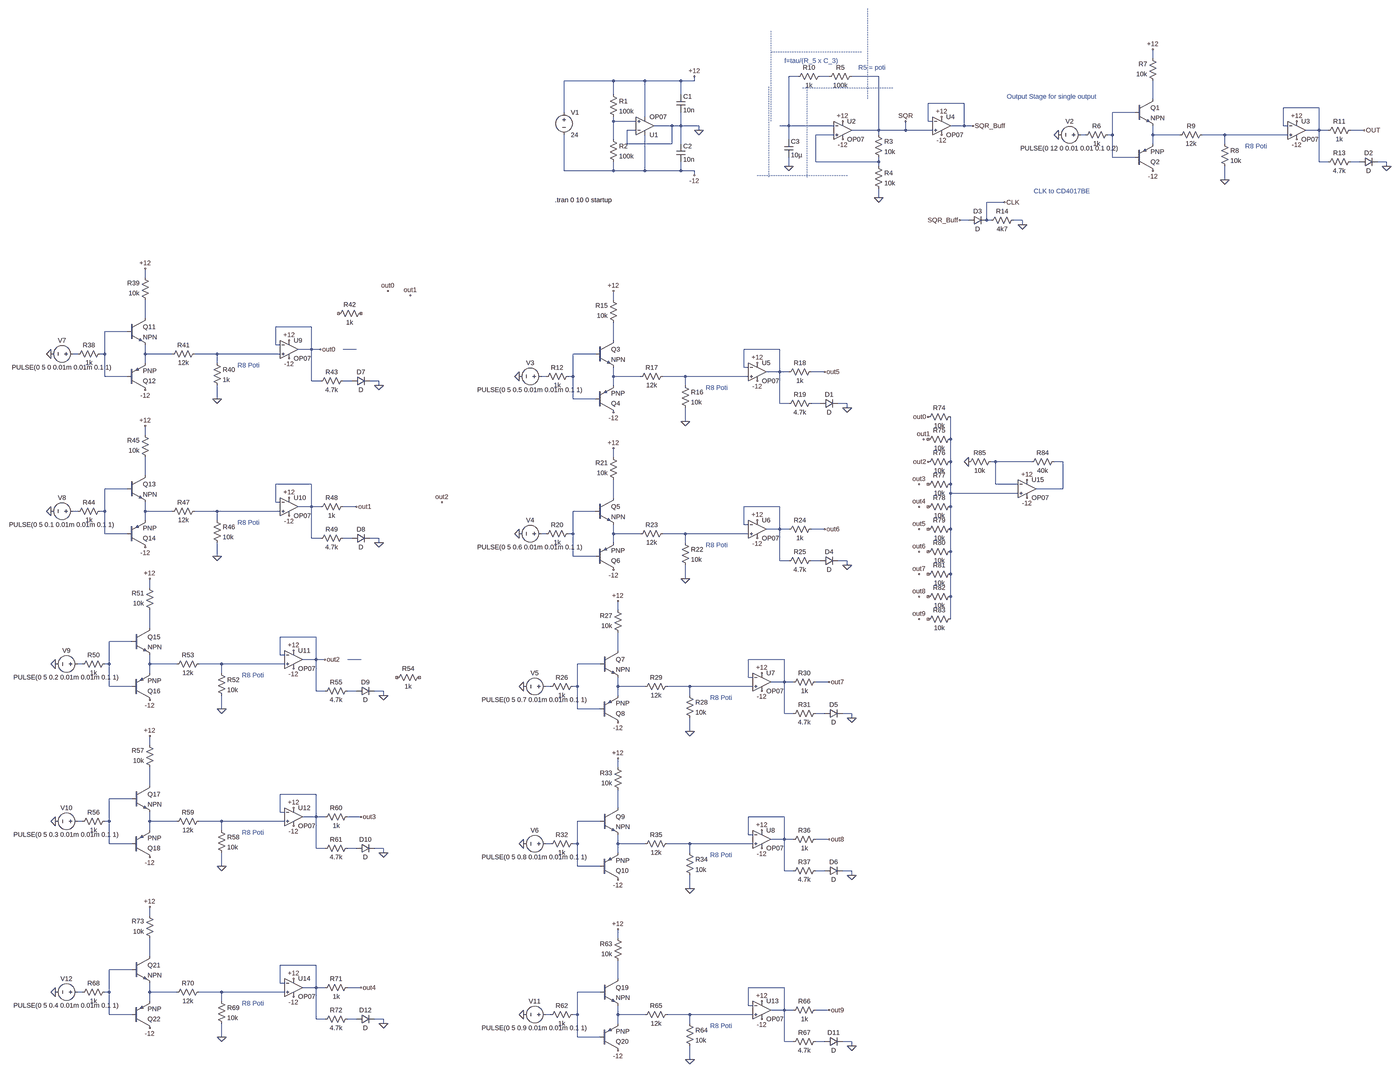
[diagram p0: schematic Draft1.asc, whole sheet]
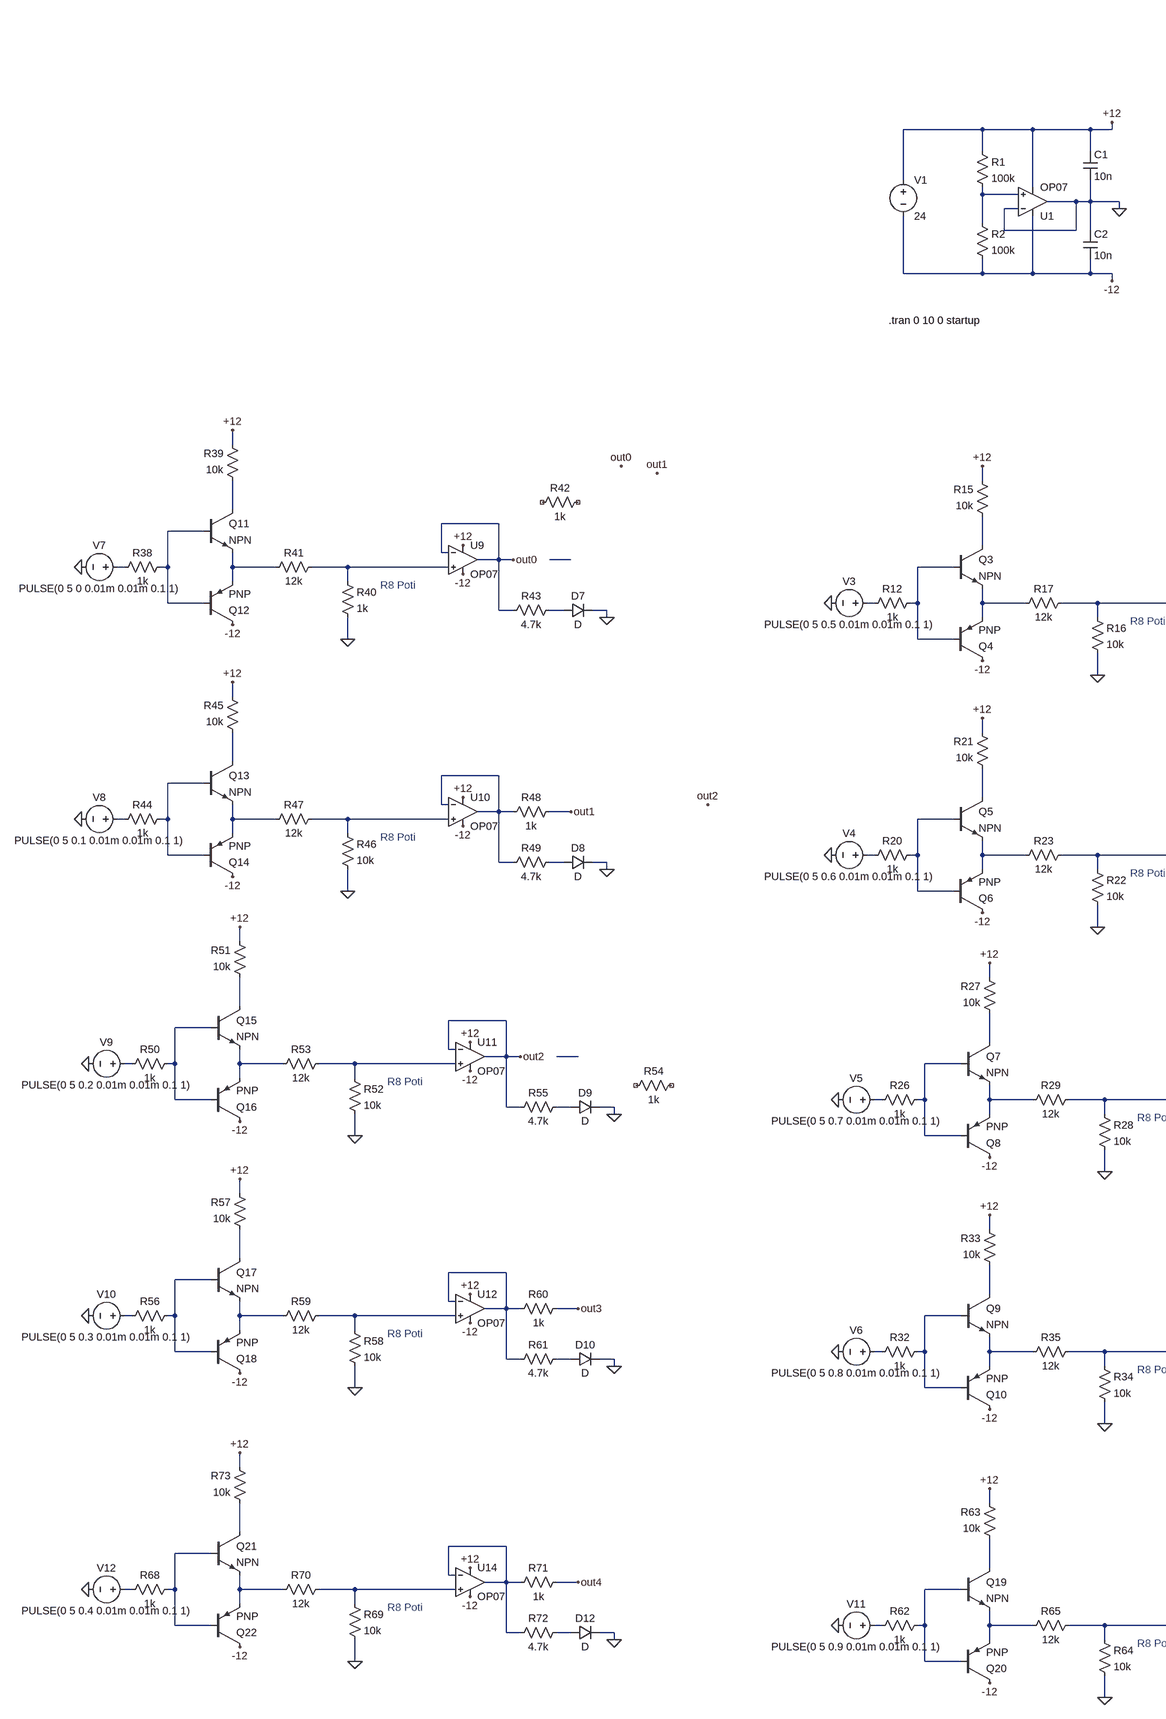
[diagram p1: schematic Draft1.asc, part, row 1 of 1, column 1 of 2]
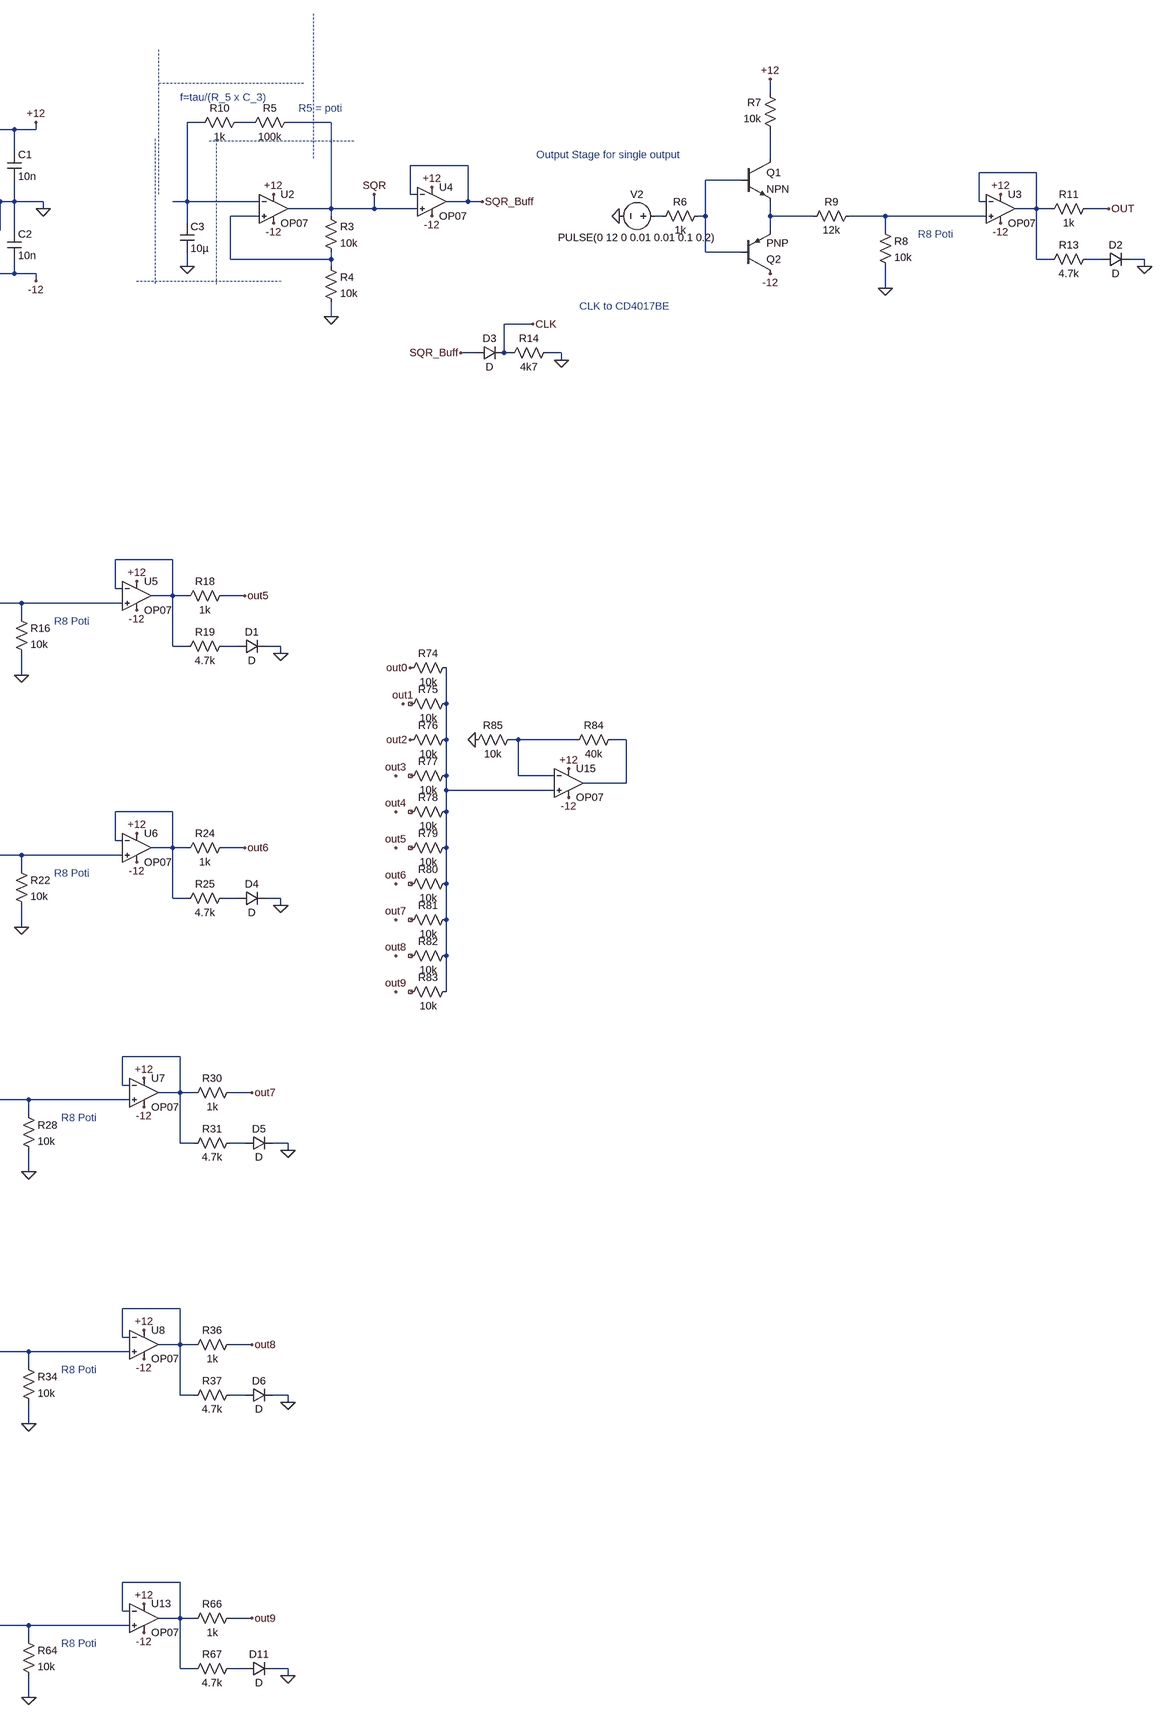
[diagram p2: schematic Draft1.asc, part, row 1 of 1, column 2 of 2]
Draft1.asc, the LTspice schematic file:
Version 4.1
SHEET 1 2912 3476
WIRE 1936 -240 1936 -272
WIRE 672 -176 640 -176
WIRE 784 -176 752 -176
WIRE 960 -176 864 -176
WIRE 16 -160 -160 -160
WIRE 128 -160 16 -160
WIRE 256 -160 128 -160
WIRE 304 -160 304 -176
WIRE 304 -160 256 -160
WIRE 16 -112 16 -160
WIRE 256 -112 256 -160
WIRE 1936 -96 1936 -160
WIRE 1264 -80 1136 -80
WIRE 2528 -64 2400 -64
WIRE -160 -48 -160 -160
WIRE 1872 -48 1792 -48
WIRE 128 -32 128 -160
WIRE 16 -16 16 -32
WIRE 96 -16 16 -16
WIRE 1136 -16 1136 -80
WIRE 1152 -16 1136 -16
WIRE 224 0 160 0
WIRE 256 0 256 -48
WIRE 256 0 224 0
WIRE 320 0 256 0
WIRE 640 0 640 -176
WIRE 640 0 608 0
WIRE 800 0 640 0
WIRE 1264 0 1264 -80
WIRE 1264 0 1216 0
WIRE 1296 0 1264 0
WIRE 2400 0 2400 -64
WIRE 2416 0 2400 0
WIRE 96 16 64 16
WIRE 320 16 320 0
WIRE 960 16 960 -176
WIRE 960 16 864 16
WIRE 1056 16 1056 -16
WIRE 1056 16 960 16
WIRE 1152 16 1056 16
WIRE 2528 16 2528 -64
WIRE 2528 16 2480 16
WIRE 2560 16 2528 16
WIRE 2688 16 2640 16
WIRE 800 32 736 32
WIRE 960 32 960 16
WIRE 1696 32 1680 32
WIRE 1792 32 1792 -48
WIRE 1792 32 1776 32
WIRE 1936 32 1936 0
WIRE 2032 32 1936 32
WIRE 2192 32 2112 32
WIRE 2416 32 2192 32
WIRE 16 48 16 -16
WIRE 640 48 640 0
WIRE 64 64 64 16
WIRE 224 64 224 0
WIRE 224 64 64 64
WIRE 256 64 256 0
WIRE 1936 64 1936 32
WIRE 2192 64 2192 32
WIRE 1792 112 1792 32
WIRE 1872 112 1792 112
WIRE 736 128 736 32
WIRE 960 128 960 112
WIRE 960 128 736 128
WIRE 2528 128 2528 16
WIRE 2560 128 2528 128
WIRE 2672 128 2640 128
WIRE 2768 128 2736 128
WIRE 640 144 640 112
WIRE 960 144 960 128
WIRE 2768 144 2768 128
WIRE -160 160 -160 32
WIRE 16 160 16 128
WIRE 16 160 -160 160
WIRE 128 160 128 32
WIRE 128 160 16 160
WIRE 256 160 256 128
WIRE 256 160 128 160
WIRE 304 160 256 160
WIRE 304 176 304 160
WIRE 2192 192 2192 144
WIRE 960 256 960 224
WIRE 1408 272 1344 272
WIRE 1280 336 1248 336
WIRE 1344 336 1344 272
WIRE 1360 336 1344 336
WIRE 1472 336 1440 336
WIRE 1472 352 1472 336
WIRE -1664 640 -1664 608
WIRE 16 720 16 688
WIRE -1664 784 -1664 720
WIRE -1072 816 -1200 816
WIRE -1728 832 -1808 832
WIRE 16 864 16 800
WIRE -1200 880 -1200 816
WIRE -1184 880 -1200 880
WIRE -1072 896 -1072 816
WIRE -1072 896 -1120 896
WIRE -1040 896 -1072 896
WIRE -912 896 -960 896
WIRE 608 896 480 896
WIRE -1904 912 -1920 912
WIRE -1808 912 -1808 832
WIRE -1808 912 -1824 912
WIRE -1664 912 -1664 880
WIRE -1568 912 -1664 912
WIRE -1408 912 -1488 912
WIRE -1184 912 -1408 912
WIRE -48 912 -128 912
WIRE -1664 944 -1664 912
WIRE -1408 944 -1408 912
WIRE 480 960 480 896
WIRE 496 960 480 960
WIRE 608 976 608 896
WIRE 608 976 560 976
WIRE 640 976 608 976
WIRE 768 976 720 976
WIRE -1808 992 -1808 912
WIRE -1728 992 -1808 992
WIRE -224 992 -240 992
WIRE -128 992 -128 912
WIRE -128 992 -144 992
WIRE 16 992 16 960
WIRE 112 992 16 992
WIRE 272 992 192 992
WIRE 496 992 272 992
WIRE -1072 1008 -1072 896
WIRE -1040 1008 -1072 1008
WIRE -928 1008 -960 1008
WIRE -832 1008 -864 1008
WIRE -832 1024 -832 1008
WIRE 16 1024 16 992
WIRE 272 1024 272 992
WIRE -1408 1072 -1408 1024
WIRE -128 1072 -128 992
WIRE -48 1072 -128 1072
WIRE 608 1088 608 976
WIRE 640 1088 608 1088
WIRE 752 1088 720 1088
WIRE 848 1088 816 1088
WIRE 848 1104 848 1088
WIRE 272 1152 272 1104
WIRE -1664 1200 -1664 1168
WIRE 1216 1216 1216 1136
WIRE 16 1280 16 1248
WIRE 1216 1296 1216 1216
WIRE 1376 1296 1360 1296
WIRE 1504 1296 1376 1296
WIRE 1616 1296 1584 1296
WIRE -1664 1344 -1664 1280
WIRE -1072 1376 -1200 1376
WIRE 1216 1376 1216 1296
WIRE 1376 1376 1376 1296
WIRE 1456 1376 1376 1376
WIRE -1728 1392 -1808 1392
WIRE 1616 1392 1616 1296
WIRE 1616 1392 1520 1392
WIRE 1216 1408 1216 1376
WIRE 1456 1408 1216 1408
WIRE 16 1424 16 1360
WIRE -1200 1440 -1200 1376
WIRE -1184 1440 -1200 1440
WIRE -1072 1456 -1072 1376
WIRE -1072 1456 -1120 1456
WIRE -1040 1456 -1072 1456
WIRE -912 1456 -960 1456
WIRE 608 1456 480 1456
WIRE 1216 1456 1216 1408
WIRE -1904 1472 -1920 1472
WIRE -1808 1472 -1808 1392
WIRE -1808 1472 -1824 1472
WIRE -1664 1472 -1664 1440
WIRE -1568 1472 -1664 1472
WIRE -1408 1472 -1488 1472
WIRE -1184 1472 -1408 1472
WIRE -48 1472 -128 1472
WIRE -1664 1504 -1664 1472
WIRE -1408 1504 -1408 1472
WIRE 480 1520 480 1456
WIRE 496 1520 480 1520
WIRE 608 1536 608 1456
WIRE 608 1536 560 1536
WIRE 640 1536 608 1536
WIRE 768 1536 720 1536
WIRE 1216 1536 1216 1456
WIRE -1808 1552 -1808 1472
WIRE -1728 1552 -1808 1552
WIRE -224 1552 -240 1552
WIRE -128 1552 -128 1472
WIRE -128 1552 -144 1552
WIRE 16 1552 16 1520
WIRE 112 1552 16 1552
WIRE 272 1552 192 1552
WIRE 496 1552 272 1552
WIRE -1072 1568 -1072 1456
WIRE -1040 1568 -1072 1568
WIRE -928 1568 -960 1568
WIRE -832 1568 -864 1568
WIRE -832 1584 -832 1568
WIRE 16 1584 16 1552
WIRE 272 1584 272 1552
WIRE 1216 1616 1216 1536
WIRE -1408 1632 -1408 1584
WIRE -128 1632 -128 1552
WIRE -48 1632 -128 1632
WIRE 608 1648 608 1536
WIRE 640 1648 608 1648
WIRE 752 1648 720 1648
WIRE 848 1648 816 1648
WIRE 848 1664 848 1648
WIRE 1216 1696 1216 1616
WIRE 272 1712 272 1664
WIRE -1648 1744 -1648 1712
WIRE 1216 1776 1216 1696
WIRE 32 1824 32 1792
WIRE 1216 1856 1216 1776
WIRE -1648 1888 -1648 1824
WIRE -1056 1920 -1184 1920
WIRE -1712 1936 -1792 1936
WIRE 32 1968 32 1904
WIRE -1184 1984 -1184 1920
WIRE -1168 1984 -1184 1984
WIRE -1056 2000 -1056 1920
WIRE -1056 2000 -1104 2000
WIRE -1024 2000 -1056 2000
WIRE -896 2000 -944 2000
WIRE 624 2000 496 2000
WIRE -1888 2016 -1904 2016
WIRE -1792 2016 -1792 1936
WIRE -1792 2016 -1808 2016
WIRE -1648 2016 -1648 1984
WIRE -1552 2016 -1648 2016
WIRE -1392 2016 -1472 2016
WIRE -1168 2016 -1392 2016
WIRE -32 2016 -112 2016
WIRE -1648 2048 -1648 2016
WIRE -1392 2048 -1392 2016
WIRE 496 2064 496 2000
WIRE 512 2064 496 2064
WIRE 624 2080 624 2000
WIRE 624 2080 576 2080
WIRE 656 2080 624 2080
WIRE 784 2080 736 2080
WIRE -1792 2096 -1792 2016
WIRE -1712 2096 -1792 2096
WIRE -208 2096 -224 2096
WIRE -112 2096 -112 2016
WIRE -112 2096 -128 2096
WIRE 32 2096 32 2064
WIRE 128 2096 32 2096
WIRE 288 2096 208 2096
WIRE 512 2096 288 2096
WIRE -1056 2112 -1056 2000
WIRE -1024 2112 -1056 2112
WIRE -912 2112 -944 2112
WIRE -816 2112 -848 2112
WIRE -816 2128 -816 2112
WIRE 32 2128 32 2096
WIRE 288 2128 288 2096
WIRE -1392 2176 -1392 2128
WIRE -112 2176 -112 2096
WIRE -32 2176 -112 2176
WIRE 624 2192 624 2080
WIRE 656 2192 624 2192
WIRE 768 2192 736 2192
WIRE 864 2192 832 2192
WIRE 864 2208 864 2192
WIRE 288 2256 288 2208
WIRE -1648 2304 -1648 2272
WIRE 32 2384 32 2352
WIRE -1648 2448 -1648 2384
WIRE -1056 2480 -1184 2480
WIRE -1712 2496 -1792 2496
WIRE 32 2528 32 2464
WIRE -1184 2544 -1184 2480
WIRE -1168 2544 -1184 2544
WIRE -1056 2560 -1056 2480
WIRE -1056 2560 -1104 2560
WIRE -1024 2560 -1056 2560
WIRE -896 2560 -944 2560
WIRE 624 2560 496 2560
WIRE -1888 2576 -1904 2576
WIRE -1792 2576 -1792 2496
WIRE -1792 2576 -1808 2576
WIRE -1648 2576 -1648 2544
WIRE -1552 2576 -1648 2576
WIRE -1392 2576 -1472 2576
WIRE -1168 2576 -1392 2576
WIRE -32 2576 -112 2576
WIRE -1648 2608 -1648 2576
WIRE -1392 2608 -1392 2576
WIRE 496 2624 496 2560
WIRE 512 2624 496 2624
WIRE 624 2640 624 2560
WIRE 624 2640 576 2640
WIRE 656 2640 624 2640
WIRE 784 2640 736 2640
WIRE -1792 2656 -1792 2576
WIRE -1712 2656 -1792 2656
WIRE -208 2656 -224 2656
WIRE -112 2656 -112 2576
WIRE -112 2656 -128 2656
WIRE 32 2656 32 2624
WIRE 128 2656 32 2656
WIRE 288 2656 208 2656
WIRE 512 2656 288 2656
WIRE -1056 2672 -1056 2560
WIRE -1024 2672 -1056 2672
WIRE -912 2672 -944 2672
WIRE -816 2672 -848 2672
WIRE -816 2688 -816 2672
WIRE 32 2688 32 2656
WIRE 288 2688 288 2656
WIRE -1392 2736 -1392 2688
WIRE -112 2736 -112 2656
WIRE -32 2736 -112 2736
WIRE 624 2752 624 2640
WIRE 656 2752 624 2752
WIRE 768 2752 736 2752
WIRE 864 2752 832 2752
WIRE 864 2768 864 2752
WIRE 288 2816 288 2768
WIRE -1648 2912 -1648 2880
WIRE 32 2992 32 2960
WIRE -1648 3056 -1648 2992
WIRE -1056 3088 -1184 3088
WIRE -1712 3104 -1792 3104
WIRE 32 3136 32 3072
WIRE -1184 3152 -1184 3088
WIRE -1168 3152 -1184 3152
WIRE -1056 3168 -1056 3088
WIRE -1056 3168 -1104 3168
WIRE -1024 3168 -1056 3168
WIRE -896 3168 -944 3168
WIRE 624 3168 496 3168
WIRE -1888 3184 -1904 3184
WIRE -1792 3184 -1792 3104
WIRE -1792 3184 -1808 3184
WIRE -1648 3184 -1648 3152
WIRE -1552 3184 -1648 3184
WIRE -1392 3184 -1472 3184
WIRE -1168 3184 -1392 3184
WIRE -32 3184 -112 3184
WIRE -1648 3216 -1648 3184
WIRE -1392 3216 -1392 3184
WIRE 496 3232 496 3168
WIRE 512 3232 496 3232
WIRE 624 3248 624 3168
WIRE 624 3248 576 3248
WIRE 656 3248 624 3248
WIRE 784 3248 736 3248
WIRE -1792 3264 -1792 3184
WIRE -1712 3264 -1792 3264
WIRE -208 3264 -224 3264
WIRE -112 3264 -112 3184
WIRE -112 3264 -128 3264
WIRE 32 3264 32 3232
WIRE 128 3264 32 3264
WIRE 288 3264 208 3264
WIRE 512 3264 288 3264
WIRE -1056 3280 -1056 3168
WIRE -1024 3280 -1056 3280
WIRE -912 3280 -944 3280
WIRE -816 3280 -848 3280
WIRE -816 3296 -816 3280
WIRE 32 3296 32 3264
WIRE 288 3296 288 3264
WIRE -1392 3344 -1392 3296
WIRE -112 3344 -112 3264
WIRE -32 3344 -112 3344
WIRE 624 3360 624 3248
WIRE 656 3360 624 3360
WIRE 768 3360 736 3360
WIRE 864 3360 832 3360
WIRE 864 3376 864 3360
WIRE 288 3424 288 3376
FLAG 304 -176 +12
FLAG 304 176 -12
FLAG 320 16 0
FLAG 960 256 0
FLAG 832 48 -12
FLAG 832 -16 +12
FLAG 640 144 0
FLAG 1184 -32 +12
FLAG 1184 32 -12
FLAG 1056 -16 SQR
FLAG 1296 0 SQR_Buff
FLAG 1936 -272 +12
FLAG 2192 192 0
FLAG 1936 160 -12
FLAG 2448 -16 +12
FLAG 2448 48 -12
FLAG 2768 144 0
FLAG 2688 16 OUT
FLAG 1600 32 0
FLAG 1472 352 0
FLAG 1248 336 SQR_Buff
FLAG 1408 272 CLK
FLAG 16 688 +12
FLAG 272 1152 0
FLAG 16 1120 -12
FLAG 528 944 +12
FLAG 528 1008 -12
FLAG 848 1104 0
FLAG -320 992 0
FLAG 16 1248 +12
FLAG 272 1712 0
FLAG 16 1680 -12
FLAG 528 1504 +12
FLAG 528 1568 -12
FLAG 848 1664 0
FLAG -320 1552 0
FLAG 32 1792 +12
FLAG 288 2256 0
FLAG 32 2224 -12
FLAG 544 2048 +12
FLAG 544 2112 -12
FLAG 864 2208 0
FLAG -304 2096 0
FLAG 32 2352 +12
FLAG 288 2816 0
FLAG 32 2784 -12
FLAG 544 2608 +12
FLAG 544 2672 -12
FLAG 864 2768 0
FLAG -304 2656 0
FLAG -1664 608 +12
FLAG -1408 1072 0
FLAG -1664 1040 -12
FLAG -1152 864 +12
FLAG -1152 928 -12
FLAG -832 1024 0
FLAG -2000 912 0
FLAG -1664 1168 +12
FLAG -1408 1632 0
FLAG -1664 1600 -12
FLAG -1152 1424 +12
FLAG -1152 1488 -12
FLAG -832 1584 0
FLAG -2000 1472 0
FLAG -1648 1712 +12
FLAG -1392 2176 0
FLAG -1648 2144 -12
FLAG -1136 1968 +12
FLAG -1136 2032 -12
FLAG -816 2128 0
FLAG -1984 2016 0
FLAG -1648 2272 +12
FLAG -1392 2736 0
FLAG -1648 2704 -12
FLAG -1136 2528 +12
FLAG -1136 2592 -12
FLAG -816 2688 0
FLAG -1984 2576 0
FLAG 32 2960 +12
FLAG 288 3424 0
FLAG 32 3392 -12
FLAG 544 3216 +12
FLAG 544 3280 -12
FLAG 864 3376 0
FLAG -304 3264 0
FLAG -1392 3344 0
FLAG -1648 3312 -12
FLAG -1136 3136 +12
FLAG -1136 3200 -12
FLAG -816 3296 0
FLAG -1984 3184 0
FLAG -1040 896 out0
FLAG -800 688 out0
FLAG -912 1456 out1
FLAG -720 704 out1
FLAG -1648 2880 +12
FLAG -1024 2000 out2
FLAG -608 1440 out2
FLAG -896 2560 out3
FLAG -896 3168 out4
FLAG 768 976 out5
FLAG 768 1536 out6
FLAG 784 2080 out7
FLAG 784 2640 out8
FLAG 784 3248 out9
FLAG 1488 1360 +12
FLAG 1488 1424 -12
FLAG 1136 1136 out0
FLAG 1120 1216 out1
FLAG 1136 1296 out2
FLAG 1104 1376 out3
FLAG 1104 1456 out4
FLAG 1104 1536 out5
FLAG 1104 1616 out6
FLAG 1104 1696 out7
FLAG 1104 1776 out8
FLAG 1104 1856 out9
FLAG 1280 1296 0
SYMBOL OpAmps\\OP07 128 64 M180
SYMATTR InstName U1
SYMBOL res 0 -128 R0
SYMATTR InstName R1
SYMATTR Value 100k
SYMBOL res 0 32 R0
SYMATTR InstName R2
SYMATTR Value 100k
SYMBOL cap 240 -112 R0
SYMATTR InstName C1
SYMATTR Value 10n
SYMBOL cap 240 64 R0
SYMATTR InstName C2
SYMATTR Value 10n
SYMBOL voltage -160 -64 R0
WINDOW 123 0 0 Left 0
WINDOW 39 0 0 Left 0
SYMATTR InstName V1
SYMATTR Value 24
SYMBOL OpAmps\\OP07 832 -48 R0
SYMATTR InstName U2
SYMBOL res 944 16 R0
SYMATTR InstName R3
SYMATTR Value 10k
SYMBOL res 944 128 R0
SYMATTR InstName R4
SYMATTR Value 10k
SYMBOL res 880 -192 R90
WINDOW 0 0 56 VBottom 2
WINDOW 3 32 56 VTop 2
SYMATTR InstName R5
SYMATTR Value 100k
SYMBOL cap 624 48 R0
SYMATTR InstName C3
SYMATTR Value 10µ
SYMBOL OpAmps\\OP07 1184 -64 R0
SYMATTR InstName U4
SYMBOL res 768 -192 R90
WINDOW 0 0 56 VBottom 2
WINDOW 3 32 56 VTop 2
SYMATTR InstName R10
SYMATTR Value 1k
SYMBOL npn 1872 -96 R0
SYMATTR InstName Q1
SYMBOL res 1792 16 R90
WINDOW 0 0 56 VBottom 2
WINDOW 3 32 56 VTop 2
SYMATTR InstName R6
SYMATTR Value 1k
SYMBOL res 1952 -144 R180
WINDOW 0 36 76 Left 2
WINDOW 3 36 40 Left 2
SYMATTR InstName R7
SYMATTR Value 10k
SYMBOL res 2176 48 R0
SYMATTR InstName R8
SYMATTR Value 10k
SYMBOL pnp 1872 160 M180
SYMATTR InstName Q2
SYMBOL res 2128 16 R90
WINDOW 0 0 56 VBottom 2
WINDOW 3 32 56 VTop 2
SYMATTR InstName R9
SYMATTR Value 12k
SYMBOL OpAmps\\OP07 2448 -48 R0
SYMATTR InstName U3
SYMBOL res 2656 0 R90
WINDOW 0 0 56 VBottom 2
WINDOW 3 32 56 VTop 2
SYMATTR InstName R11
SYMATTR Value 1k
SYMBOL diode 2672 144 R270
WINDOW 0 32 32 VTop 2
WINDOW 3 0 32 VBottom 2
SYMATTR InstName D2
SYMBOL res 2656 112 R90
WINDOW 0 0 56 VBottom 2
WINDOW 3 32 56 VTop 2
SYMATTR InstName R13
SYMATTR Value 4.7k
SYMBOL voltage 1696 32 R90
WINDOW 0 -32 56 VBottom 2
WINDOW 3 32 56 VTop 2
WINDOW 123 0 0 Left 0
WINDOW 39 0 0 Left 0
SYMATTR InstName V2
SYMATTR Value PULSE(0 12 0 0.01 0.01 0.1 0.2)
SYMBOL diode 1280 352 R270
WINDOW 0 32 32 VTop 2
WINDOW 3 0 32 VBottom 2
SYMATTR InstName D3
SYMBOL res 1456 320 R90
WINDOW 0 0 56 VBottom 2
WINDOW 3 32 56 VTop 2
SYMATTR InstName R14
SYMATTR Value 4k7
SYMBOL npn -48 864 R0
SYMATTR InstName Q3
SYMBOL res -128 976 R90
WINDOW 0 0 56 VBottom 2
WINDOW 3 32 56 VTop 2
SYMATTR InstName R12
SYMATTR Value 1k
SYMBOL res 32 816 R180
WINDOW 0 36 76 Left 2
WINDOW 3 36 40 Left 2
SYMATTR InstName R15
SYMATTR Value 10k
SYMBOL res 256 1008 R0
SYMATTR InstName R16
SYMATTR Value 10k
SYMBOL pnp -48 1120 M180
SYMATTR InstName Q4
SYMBOL res 208 976 R90
WINDOW 0 0 56 VBottom 2
WINDOW 3 32 56 VTop 2
SYMATTR InstName R17
SYMATTR Value 12k
SYMBOL OpAmps\\OP07 528 912 R0
SYMATTR InstName U5
SYMBOL res 736 960 R90
WINDOW 0 0 56 VBottom 2
WINDOW 3 32 56 VTop 2
SYMATTR InstName R18
SYMATTR Value 1k
SYMBOL diode 752 1104 R270
WINDOW 0 32 32 VTop 2
WINDOW 3 0 32 VBottom 2
SYMATTR InstName D1
SYMBOL res 736 1072 R90
WINDOW 0 0 56 VBottom 2
WINDOW 3 32 56 VTop 2
SYMATTR InstName R19
SYMATTR Value 4.7k
SYMBOL voltage -224 992 R90
WINDOW 0 -32 56 VBottom 2
WINDOW 3 32 56 VTop 2
WINDOW 123 0 0 Left 0
WINDOW 39 0 0 Left 0
SYMATTR InstName V3
SYMATTR Value PULSE(0 5 0.5 0.01m 0.01m 0.1 1)
SYMBOL npn -48 1424 R0
SYMATTR InstName Q5
SYMBOL res -128 1536 R90
WINDOW 0 0 56 VBottom 2
WINDOW 3 32 56 VTop 2
SYMATTR InstName R20
SYMATTR Value 1k
SYMBOL res 32 1376 R180
WINDOW 0 36 76 Left 2
WINDOW 3 36 40 Left 2
SYMATTR InstName R21
SYMATTR Value 10k
SYMBOL res 256 1568 R0
SYMATTR InstName R22
SYMATTR Value 10k
SYMBOL pnp -48 1680 M180
SYMATTR InstName Q6
SYMBOL res 208 1536 R90
WINDOW 0 0 56 VBottom 2
WINDOW 3 32 56 VTop 2
SYMATTR InstName R23
SYMATTR Value 12k
SYMBOL OpAmps\\OP07 528 1472 R0
SYMATTR InstName U6
SYMBOL res 736 1520 R90
WINDOW 0 0 56 VBottom 2
WINDOW 3 32 56 VTop 2
SYMATTR InstName R24
SYMATTR Value 1k
SYMBOL diode 752 1664 R270
WINDOW 0 32 32 VTop 2
WINDOW 3 0 32 VBottom 2
SYMATTR InstName D4
SYMBOL res 736 1632 R90
WINDOW 0 0 56 VBottom 2
WINDOW 3 32 56 VTop 2
SYMATTR InstName R25
SYMATTR Value 4.7k
SYMBOL voltage -224 1552 R90
WINDOW 0 -32 56 VBottom 2
WINDOW 3 32 56 VTop 2
WINDOW 123 0 0 Left 0
WINDOW 39 0 0 Left 0
SYMATTR InstName V4
SYMATTR Value PULSE(0 5 0.6 0.01m 0.01m 0.1 1)
SYMBOL npn -32 1968 R0
SYMATTR InstName Q7
SYMBOL res -112 2080 R90
WINDOW 0 0 56 VBottom 2
WINDOW 3 32 56 VTop 2
SYMATTR InstName R26
SYMATTR Value 1k
SYMBOL res 48 1920 R180
WINDOW 0 36 76 Left 2
WINDOW 3 36 40 Left 2
SYMATTR InstName R27
SYMATTR Value 10k
SYMBOL res 272 2112 R0
SYMATTR InstName R28
SYMATTR Value 10k
SYMBOL pnp -32 2224 M180
SYMATTR InstName Q8
SYMBOL res 224 2080 R90
WINDOW 0 0 56 VBottom 2
WINDOW 3 32 56 VTop 2
SYMATTR InstName R29
SYMATTR Value 12k
SYMBOL OpAmps\\OP07 544 2016 R0
SYMATTR InstName U7
SYMBOL res 752 2064 R90
WINDOW 0 0 56 VBottom 2
WINDOW 3 32 56 VTop 2
SYMATTR InstName R30
SYMATTR Value 1k
SYMBOL diode 768 2208 R270
WINDOW 0 32 32 VTop 2
WINDOW 3 0 32 VBottom 2
SYMATTR InstName D5
SYMBOL res 752 2176 R90
WINDOW 0 0 56 VBottom 2
WINDOW 3 32 56 VTop 2
SYMATTR InstName R31
SYMATTR Value 4.7k
SYMBOL voltage -208 2096 R90
WINDOW 0 -32 56 VBottom 2
WINDOW 3 32 56 VTop 2
WINDOW 123 0 0 Left 0
WINDOW 39 0 0 Left 0
SYMATTR InstName V5
SYMATTR Value PULSE(0 5 0.7 0.01m 0.01m 0.1 1)
SYMBOL npn -32 2528 R0
SYMATTR InstName Q9
SYMBOL res -112 2640 R90
WINDOW 0 0 56 VBottom 2
WINDOW 3 32 56 VTop 2
SYMATTR InstName R32
SYMATTR Value 1k
SYMBOL res 48 2480 R180
WINDOW 0 36 76 Left 2
WINDOW 3 36 40 Left 2
SYMATTR InstName R33
SYMATTR Value 10k
SYMBOL res 272 2672 R0
SYMATTR InstName R34
SYMATTR Value 10k
SYMBOL pnp -32 2784 M180
SYMATTR InstName Q10
SYMBOL res 224 2640 R90
WINDOW 0 0 56 VBottom 2
WINDOW 3 32 56 VTop 2
SYMATTR InstName R35
SYMATTR Value 12k
SYMBOL OpAmps\\OP07 544 2576 R0
SYMATTR InstName U8
SYMBOL res 752 2624 R90
WINDOW 0 0 56 VBottom 2
WINDOW 3 32 56 VTop 2
SYMATTR InstName R36
SYMATTR Value 1k
SYMBOL diode 768 2768 R270
WINDOW 0 32 32 VTop 2
WINDOW 3 0 32 VBottom 2
SYMATTR InstName D6
SYMBOL res 752 2736 R90
WINDOW 0 0 56 VBottom 2
WINDOW 3 32 56 VTop 2
SYMATTR InstName R37
SYMATTR Value 4.7k
SYMBOL voltage -208 2656 R90
WINDOW 0 -32 56 VBottom 2
WINDOW 3 32 56 VTop 2
WINDOW 123 0 0 Left 0
WINDOW 39 0 0 Left 0
SYMATTR InstName V6
SYMATTR Value PULSE(0 5 0.8 0.01m 0.01m 0.1 1)
SYMBOL npn -1728 784 R0
SYMATTR InstName Q11
SYMBOL res -1808 896 R90
WINDOW 0 0 56 VBottom 2
WINDOW 3 32 56 VTop 2
SYMATTR InstName R38
SYMATTR Value 1k
SYMBOL res -1648 736 R180
WINDOW 0 36 76 Left 2
WINDOW 3 36 40 Left 2
SYMATTR InstName R39
SYMATTR Value 10k
SYMBOL res -1424 928 R0
SYMATTR InstName R40
SYMATTR Value 1k
SYMBOL pnp -1728 1040 M180
SYMATTR InstName Q12
SYMBOL res -1472 896 R90
WINDOW 0 0 56 VBottom 2
WINDOW 3 32 56 VTop 2
SYMATTR InstName R41
SYMATTR Value 12k
SYMBOL OpAmps\\OP07 -1152 832 R0
SYMATTR InstName U9
SYMBOL res -880 752 R90
WINDOW 0 0 56 VBottom 2
WINDOW 3 32 56 VTop 2
SYMATTR InstName R42
SYMATTR Value 1k
SYMBOL diode -928 1024 R270
WINDOW 0 32 32 VTop 2
WINDOW 3 0 32 VBottom 2
SYMATTR InstName D7
SYMBOL res -944 992 R90
WINDOW 0 0 56 VBottom 2
WINDOW 3 32 56 VTop 2
SYMATTR InstName R43
SYMATTR Value 4.7k
SYMBOL voltage -1904 912 R90
WINDOW 0 -32 56 VBottom 2
WINDOW 3 32 56 VTop 2
WINDOW 123 0 0 Left 0
WINDOW 39 0 0 Left 0
SYMATTR InstName V7
SYMATTR Value PULSE(0 5 0 0.01m 0.01m 0.1 1)
SYMBOL npn -1728 1344 R0
SYMATTR InstName Q13
SYMBOL res -1808 1456 R90
WINDOW 0 0 56 VBottom 2
WINDOW 3 32 56 VTop 2
SYMATTR InstName R44
SYMATTR Value 1k
SYMBOL res -1648 1296 R180
WINDOW 0 36 76 Left 2
WINDOW 3 36 40 Left 2
SYMATTR InstName R45
SYMATTR Value 10k
SYMBOL res -1424 1488 R0
SYMATTR InstName R46
SYMATTR Value 10k
SYMBOL pnp -1728 1600 M180
SYMATTR InstName Q14
SYMBOL res -1472 1456 R90
WINDOW 0 0 56 VBottom 2
WINDOW 3 32 56 VTop 2
SYMATTR InstName R47
SYMATTR Value 12k
SYMBOL OpAmps\\OP07 -1152 1392 R0
SYMATTR InstName U10
SYMBOL res -944 1440 R90
WINDOW 0 0 56 VBottom 2
WINDOW 3 32 56 VTop 2
SYMATTR InstName R48
SYMATTR Value 1k
SYMBOL diode -928 1584 R270
WINDOW 0 32 32 VTop 2
WINDOW 3 0 32 VBottom 2
SYMATTR InstName D8
SYMBOL res -944 1552 R90
WINDOW 0 0 56 VBottom 2
WINDOW 3 32 56 VTop 2
SYMATTR InstName R49
SYMATTR Value 4.7k
SYMBOL voltage -1904 1472 R90
WINDOW 0 -32 56 VBottom 2
WINDOW 3 32 56 VTop 2
WINDOW 123 0 0 Left 0
WINDOW 39 0 0 Left 0
SYMATTR InstName V8
SYMATTR Value PULSE(0 5 0.1 0.01m 0.01m 0.1 1)
SYMBOL npn -1712 1888 R0
SYMATTR InstName Q15
SYMBOL res -1792 2000 R90
WINDOW 0 0 56 VBottom 2
WINDOW 3 32 56 VTop 2
SYMATTR InstName R50
SYMATTR Value 1k
SYMBOL res -1632 1840 R180
WINDOW 0 36 76 Left 2
WINDOW 3 36 40 Left 2
SYMATTR InstName R51
SYMATTR Value 10k
SYMBOL res -1408 2032 R0
SYMATTR InstName R52
SYMATTR Value 10k
SYMBOL pnp -1712 2144 M180
SYMATTR InstName Q16
SYMBOL res -1456 2000 R90
WINDOW 0 0 56 VBottom 2
WINDOW 3 32 56 VTop 2
SYMATTR InstName R53
SYMATTR Value 12k
SYMBOL OpAmps\\OP07 -1136 1936 R0
SYMATTR InstName U11
SYMBOL res -672 2048 R90
WINDOW 0 0 56 VBottom 2
WINDOW 3 32 56 VTop 2
SYMATTR InstName R54
SYMATTR Value 1k
SYMBOL diode -912 2128 R270
WINDOW 0 32 32 VTop 2
WINDOW 3 0 32 VBottom 2
SYMATTR InstName D9
SYMBOL res -928 2096 R90
WINDOW 0 0 56 VBottom 2
WINDOW 3 32 56 VTop 2
SYMATTR InstName R55
SYMATTR Value 4.7k
SYMBOL voltage -1888 2016 R90
WINDOW 0 -32 56 VBottom 2
WINDOW 3 32 56 VTop 2
WINDOW 123 0 0 Left 0
WINDOW 39 0 0 Left 0
SYMATTR InstName V9
SYMATTR Value PULSE(0 5 0.2 0.01m 0.01m 0.1 1)
SYMBOL npn -1712 2448 R0
SYMATTR InstName Q17
SYMBOL res -1792 2560 R90
WINDOW 0 0 56 VBottom 2
WINDOW 3 32 56 VTop 2
SYMATTR InstName R56
SYMATTR Value 1k
SYMBOL res -1632 2400 R180
WINDOW 0 36 76 Left 2
WINDOW 3 36 40 Left 2
SYMATTR InstName R57
SYMATTR Value 10k
SYMBOL res -1408 2592 R0
SYMATTR InstName R58
SYMATTR Value 10k
SYMBOL pnp -1712 2704 M180
SYMATTR InstName Q18
SYMBOL res -1456 2560 R90
WINDOW 0 0 56 VBottom 2
WINDOW 3 32 56 VTop 2
SYMATTR InstName R59
SYMATTR Value 12k
SYMBOL OpAmps\\OP07 -1136 2496 R0
SYMATTR InstName U12
SYMBOL res -928 2544 R90
WINDOW 0 0 56 VBottom 2
WINDOW 3 32 56 VTop 2
SYMATTR InstName R60
SYMATTR Value 1k
SYMBOL diode -912 2688 R270
WINDOW 0 32 32 VTop 2
WINDOW 3 0 32 VBottom 2
SYMATTR InstName D10
SYMBOL res -928 2656 R90
WINDOW 0 0 56 VBottom 2
WINDOW 3 32 56 VTop 2
SYMATTR InstName R61
SYMATTR Value 4.7k
SYMBOL voltage -1888 2576 R90
WINDOW 0 -32 56 VBottom 2
WINDOW 3 32 56 VTop 2
WINDOW 123 0 0 Left 0
WINDOW 39 0 0 Left 0
SYMATTR InstName V10
SYMATTR Value PULSE(0 5 0.3 0.01m 0.01m 0.1 1)
SYMBOL npn -32 3136 R0
SYMATTR InstName Q19
SYMBOL res -112 3248 R90
WINDOW 0 0 56 VBottom 2
WINDOW 3 32 56 VTop 2
SYMATTR InstName R62
SYMATTR Value 1k
SYMBOL res 48 3088 R180
WINDOW 0 36 76 Left 2
WINDOW 3 36 40 Left 2
SYMATTR InstName R63
SYMATTR Value 10k
SYMBOL res 272 3280 R0
SYMATTR InstName R64
SYMATTR Value 10k
SYMBOL pnp -32 3392 M180
SYMATTR InstName Q20
SYMBOL res 224 3248 R90
WINDOW 0 0 56 VBottom 2
WINDOW 3 32 56 VTop 2
SYMATTR InstName R65
SYMATTR Value 12k
SYMBOL OpAmps\\OP07 544 3184 R0
SYMATTR InstName U13
SYMBOL res 752 3232 R90
WINDOW 0 0 56 VBottom 2
WINDOW 3 32 56 VTop 2
SYMATTR InstName R66
SYMATTR Value 1k
SYMBOL diode 768 3376 R270
WINDOW 0 32 32 VTop 2
WINDOW 3 0 32 VBottom 2
SYMATTR InstName D11
SYMBOL res 752 3344 R90
WINDOW 0 0 56 VBottom 2
WINDOW 3 32 56 VTop 2
SYMATTR InstName R67
SYMATTR Value 4.7k
SYMBOL voltage -208 3264 R90
WINDOW 0 -32 56 VBottom 2
WINDOW 3 32 56 VTop 2
WINDOW 123 0 0 Left 0
WINDOW 39 0 0 Left 0
SYMATTR InstName V11
SYMATTR Value PULSE(0 5 0.9 0.01m 0.01m 0.1 1)
SYMBOL npn -1712 3056 R0
SYMATTR InstName Q21
SYMBOL res -1792 3168 R90
WINDOW 0 0 56 VBottom 2
WINDOW 3 32 56 VTop 2
SYMATTR InstName R68
SYMATTR Value 1k
SYMBOL res -1408 3200 R0
SYMATTR InstName R69
SYMATTR Value 10k
SYMBOL pnp -1712 3312 M180
SYMATTR InstName Q22
SYMBOL res -1456 3168 R90
WINDOW 0 0 56 VBottom 2
WINDOW 3 32 56 VTop 2
SYMATTR InstName R70
SYMATTR Value 12k
SYMBOL OpAmps\\OP07 -1136 3104 R0
SYMATTR InstName U14
SYMBOL res -928 3152 R90
WINDOW 0 0 56 VBottom 2
WINDOW 3 32 56 VTop 2
SYMATTR InstName R71
SYMATTR Value 1k
SYMBOL diode -912 3296 R270
WINDOW 0 32 32 VTop 2
WINDOW 3 0 32 VBottom 2
SYMATTR InstName D12
SYMBOL res -928 3264 R90
WINDOW 0 0 56 VBottom 2
WINDOW 3 32 56 VTop 2
SYMATTR InstName R72
SYMATTR Value 4.7k
SYMBOL voltage -1888 3184 R90
WINDOW 0 -32 56 VBottom 2
WINDOW 3 32 56 VTop 2
WINDOW 123 0 0 Left 0
WINDOW 39 0 0 Left 0
SYMATTR InstName V12
SYMATTR Value PULSE(0 5 0.4 0.01m 0.01m 0.1 1)
SYMBOL res -1632 3008 R180
WINDOW 0 36 76 Left 2
WINDOW 3 36 40 Left 2
SYMATTR InstName R73
SYMATTR Value 10k
SYMBOL OpAmps\\OP07 1488 1328 R0
SYMATTR InstName U15
SYMBOL res 1232 1120 R90
WINDOW 0 0 56 VBottom 2
WINDOW 3 32 56 VTop 2
SYMATTR InstName R74
SYMATTR Value 10k
SYMBOL res 1232 1200 R90
WINDOW 0 0 56 VBottom 2
WINDOW 3 32 56 VTop 2
SYMATTR InstName R75
SYMATTR Value 10k
SYMBOL res 1232 1280 R90
WINDOW 0 0 56 VBottom 2
WINDOW 3 32 56 VTop 2
SYMATTR InstName R76
SYMATTR Value 10k
SYMBOL res 1232 1360 R90
WINDOW 0 0 56 VBottom 2
WINDOW 3 32 56 VTop 2
SYMATTR InstName R77
SYMATTR Value 10k
SYMBOL res 1232 1440 R90
WINDOW 0 0 56 VBottom 2
WINDOW 3 32 56 VTop 2
SYMATTR InstName R78
SYMATTR Value 10k
SYMBOL res 1232 1520 R90
WINDOW 0 0 56 VBottom 2
WINDOW 3 32 56 VTop 2
SYMATTR InstName R79
SYMATTR Value 10k
SYMBOL res 1232 1600 R90
WINDOW 0 0 56 VBottom 2
WINDOW 3 32 56 VTop 2
SYMATTR InstName R80
SYMATTR Value 10k
SYMBOL res 1232 1680 R90
WINDOW 0 0 56 VBottom 2
WINDOW 3 32 56 VTop 2
SYMATTR InstName R81
SYMATTR Value 10k
SYMBOL res 1232 1760 R90
WINDOW 0 0 56 VBottom 2
WINDOW 3 32 56 VTop 2
SYMATTR InstName R82
SYMATTR Value 10k
SYMBOL res 1232 1840 R90
WINDOW 0 0 56 VBottom 2
WINDOW 3 32 56 VTop 2
SYMATTR InstName R83
SYMATTR Value 10k
SYMBOL res 1600 1280 R90
WINDOW 0 0 56 VBottom 2
WINDOW 3 32 56 VTop 2
SYMATTR InstName R84
SYMATTR Value 40k
SYMBOL res 1376 1280 R90
WINDOW 0 0 56 VBottom 2
WINDOW 3 32 56 VTop 2
SYMATTR InstName R85
SYMATTR Value 10k
TEXT -192 264 Left 2 !.tran 0 10 0 startup
TEXT 624 -232 Left 2 ;f=tau/(R_5 x C_3)
TEXT 688 -136 Left 2 ;---------------------------------------
TEXT 704 -136 VRight 2 ;---------------------------------------
TEXT 848 176 Right 2 ;---------------------------------------
TEXT 568 184 VLeft 2 ;---------------------------------------
TEXT 576 -264 Left 2 ;---------------------------------------
TEXT 920 -416 VRight 2 ;---------------------------------------
TEXT 576 -336 VRight 2 ;---------------------------------------
TEXT 888 -208 Left 2 ;R5 = poti
TEXT 2264 72 Left 2 ;R8 Poti
TEXT 1512 232 Left 2 ;CLK to CD4017BE
TEXT 1416 -104 Left 2 ;Output Stage for single output
TEXT 344 1032 Left 2 ;R8 Poti
TEXT 344 1592 Left 2 ;R8 Poti
TEXT 360 2136 Left 2 ;R8 Poti
TEXT 360 2696 Left 2 ;R8 Poti
TEXT -1336 952 Left 2 ;R8 Poti
TEXT -1336 1512 Left 2 ;R8 Poti
TEXT -1320 2056 Left 2 ;R8 Poti
TEXT -1320 2616 Left 2 ;R8 Poti
TEXT 360 3304 Left 2 ;R8 Poti
TEXT -1320 3224 Left 2 ;R8 Poti

The netlist it stands for:
* Draft1.asc
X§U1 N006 0 -12 +12 0 LT1001  ; OP07, pins In+ In- V+ V- OUT
R1 +12 N006 100k
R2 N006 -12 100k
C1 +12 0 10n
C2 0 -12 10n
V1 +12 -12 24
X§U2 N007 N001 +12 -12 SQR LT1001  ; OP07, pins In+ In- V+ V- OUT
R3 SQR N007 10k
R4 N007 0 10k
R5 SQR N002 100k
C3 N001 0 10µ
X§U4 SQR SQR_Buff +12 -12 SQR_Buff LT1001  ; OP07, pins In+ In- V+ V- OUT
R10 N002 N001 1k
Q1 N003 N005 N009 0 NPN
R6 N005 N008 1k
R7 N003 +12 10k
R8 N010 0 10k
Q2 -12 N005 N009 0 PNP
R9 N010 N009 12k
X§U3 N010 N004 +12 -12 N004 LT1001  ; OP07, pins In+ In- V+ V- OUT
R11 OUT N004 1k
D2 N011 0 D
R13 N011 N004 4.7k
V2 N008 0 PULSE(0 12 0 0.01 0.01 0.1 0.2)
D3 SQR_Buff CLK D
R14 0 CLK 4k7
Q3 N014 N020 N022 0 NPN
R12 N020 N021 1k
R15 N014 +12 10k
R16 N023 0 10k
Q4 -12 N020 N022 0 PNP
R17 N023 N022 12k
X§U5 N023 N016 +12 -12 N016 LT1001  ; OP07, pins In+ In- V+ V- OUT
R18 out5 N016 1k
D1 N025 0 D
R19 N025 N016 4.7k
V3 N021 0 PULSE(0 5 0.5 0.01m 0.01m 0.1 1)
Q5 N032 N037 N039 0 NPN
R20 N037 N038 1k
R21 N032 +12 10k
R22 N040 0 10k
Q6 -12 N037 N039 0 PNP
R23 N040 N039 12k
X§U6 N040 N033 +12 -12 N033 LT1001  ; OP07, pins In+ In- V+ V- OUT
R24 out6 N033 1k
D4 N042 0 D
R25 N042 N033 4.7k
V4 N038 0 PULSE(0 5 0.6 0.01m 0.01m 0.1 1)
Q7 N045 N051 N053 0 NPN
R26 N051 N052 1k
R27 N045 +12 10k
R28 N054 0 10k
Q8 -12 N051 N053 0 PNP
R29 N054 N053 12k
X§U7 N054 N047 +12 -12 N047 LT1001  ; OP07, pins In+ In- V+ V- OUT
R30 out7 N047 1k
D5 N056 0 D
R31 N056 N047 4.7k
V5 N052 0 PULSE(0 5 0.7 0.01m 0.01m 0.1 1)
Q9 N060 N065 N067 0 NPN
R32 N065 N066 1k
R33 N060 +12 10k
R34 N068 0 10k
Q10 -12 N065 N067 0 PNP
R35 N068 N067 12k
X§U8 N068 N061 +12 -12 N061 LT1001  ; OP07, pins In+ In- V+ V- OUT
R36 out8 N061 1k
D6 N070 0 D
R37 N070 N061 4.7k
V6 N066 0 PULSE(0 5 0.8 0.01m 0.01m 0.1 1)
Q11 N012 N013 N018 0 NPN
R38 N013 N017 1k
R39 N012 +12 10k
R40 N019 0 1k
Q12 -12 N013 N018 0 PNP
R41 N019 N018 12k
X§U9 N019 out0 +12 -12 out0 LT1001  ; OP07, pins In+ In- V+ V- OUT
R42 NC_01 NC_02 1k
D7 N024 0 D
R43 N024 out0 4.7k
V7 N017 0 PULSE(0 5 0 0.01m 0.01m 0.1 1)
Q13 N029 N031 N035 0 NPN
R44 N031 N034 1k
R45 N029 +12 10k
R46 N036 0 10k
Q14 -12 N031 N035 0 PNP
R47 N036 N035 12k
X§U10 N036 N030 +12 -12 N030 LT1001  ; OP07, pins In+ In- V+ V- OUT
R48 out1 N030 1k
D8 N041 0 D
R49 N041 N030 4.7k
V8 N034 0 PULSE(0 5 0.1 0.01m 0.01m 0.1 1)
Q15 N043 N044 N049 0 NPN
R50 N044 N048 1k
R51 N043 +12 10k
R52 N050 0 10k
Q16 -12 N044 N049 0 PNP
R53 N050 N049 12k
X§U11 N050 out2 +12 -12 out2 LT1001  ; OP07, pins In+ In- V+ V- OUT
R54 NC_03 NC_04 1k
D9 N055 0 D
R55 N055 out2 4.7k
V9 N048 0 PULSE(0 5 0.2 0.01m 0.01m 0.1 1)
Q17 N057 N059 N063 0 NPN
R56 N059 N062 1k
R57 N057 +12 10k
R58 N064 0 10k
Q18 -12 N059 N063 0 PNP
R59 N064 N063 12k
X§U12 N064 N058 +12 -12 N058 LT1001  ; OP07, pins In+ In- V+ V- OUT
R60 out3 N058 1k
D10 N069 0 D
R61 N069 N058 4.7k
V10 N062 0 PULSE(0 5 0.3 0.01m 0.01m 0.1 1)
Q19 N074 N079 N081 0 NPN
R62 N079 N080 1k
R63 N074 +12 10k
R64 N082 0 10k
Q20 -12 N079 N081 0 PNP
R65 N082 N081 12k
X§U13 N082 N075 +12 -12 N075 LT1001  ; OP07, pins In+ In- V+ V- OUT
R66 out9 N075 1k
D11 N084 0 D
R67 N084 N075 4.7k
V11 N080 0 PULSE(0 5 0.9 0.01m 0.01m 0.1 1)
Q21 N071 N073 N077 0 NPN
R68 N073 N076 1k
R69 N078 0 10k
Q22 -12 N073 N077 0 PNP
R70 N078 N077 12k
X§U14 N078 N072 +12 -12 N072 LT1001  ; OP07, pins In+ In- V+ V- OUT
R71 out4 N072 1k
D12 N083 0 D
R72 N083 N072 4.7k
V12 N076 0 PULSE(0 5 0.4 0.01m 0.01m 0.1 1)
R73 N071 +12 10k
X§U15 N026 N027 +12 -12 N028 LT1001  ; OP07, pins In+ In- V+ V- OUT
R74 N026 out0 10k
R75 N026 NC_05 10k
R76 N026 out2 10k
R77 N026 NC_06 10k
R78 N026 NC_07 10k
R79 N026 NC_08 10k
R80 N026 NC_09 10k
R81 N026 NC_10 10k
R82 N026 NC_11 10k
R83 N026 NC_12 10k
R84 N028 N027 40k
R85 N027 0 10k
.model D D
.lib standard.dio
.model NPN NPN
.model PNP PNP
.lib standard.bjt
.tran 0 10 0 startup
* f=tau/(R_5 x C_3)
* ---------------------------------------
* ---------------------------------------
* ---------------------------------------
* ---------------------------------------
* ---------------------------------------
* ---------------------------------------
* ---------------------------------------
* R5 = poti
* R8 Poti
* CLK to CD4017BE
* Output Stage for single output
* R8 Poti
* R8 Poti
* R8 Poti
* R8 Poti
* R8 Poti
* R8 Poti
* R8 Poti
* R8 Poti
* R8 Poti
* R8 Poti
.lib LTC.lib
.backanno
.end